# Altium project Battery_module.PrjPCB
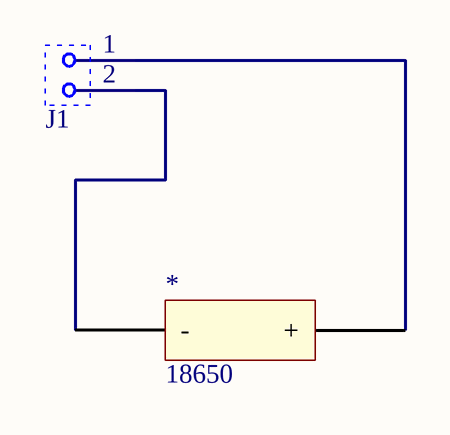
[diagram p0: battery_module.SchDoc]
1 sheet, 2 parts. Net scope: global (net labels, ports and power ports of the same name join across sheets).
Board file: battery_module.PcbDoc

## Sheet battery_module.SchDoc
size A4

### Parts
B1  18650  [18650]
J1  Molex Microfit  [MICROFIT 1x2 Vertical]  (value not drawn)

### Nets
NetB1_1: B1.1(+) J1.1
NetB1_2: B1.2(-) J1.2

### Library data of the parts
B1 = 18650: Symbol: KEYSTONE 54
J1 = Microfit 2x1: Symbol: Molex 430450212; Supplier: TME